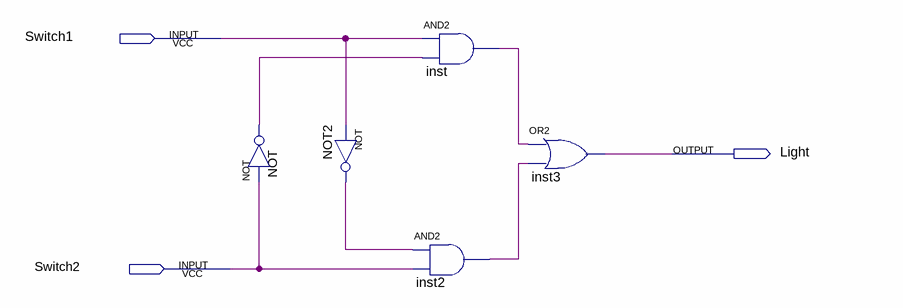
[diagram p0: schematic sheet]
// Quartus schematic Firstproj.bdf as structural Verilog: 5 symbols, 3 pins
module Firstproj (
  input  Switch1,
  input  Switch2,
  output Light
);

  wire inst2_out, inst_out, NOT2_out, NOT_out;

  not NOT (NOT_out, Switch2);
  not NOT2 (NOT2_out, Switch1);
  and inst (inst_out, Switch1, NOT_out);
  and inst2 (inst2_out, NOT2_out, Switch2);
  or inst3 (Light, inst_out, inst2_out);
endmodule
